# EAGLE design NEW LINE 十字1 (EAGLE 9.6.2)

## Sheet 1 of 3
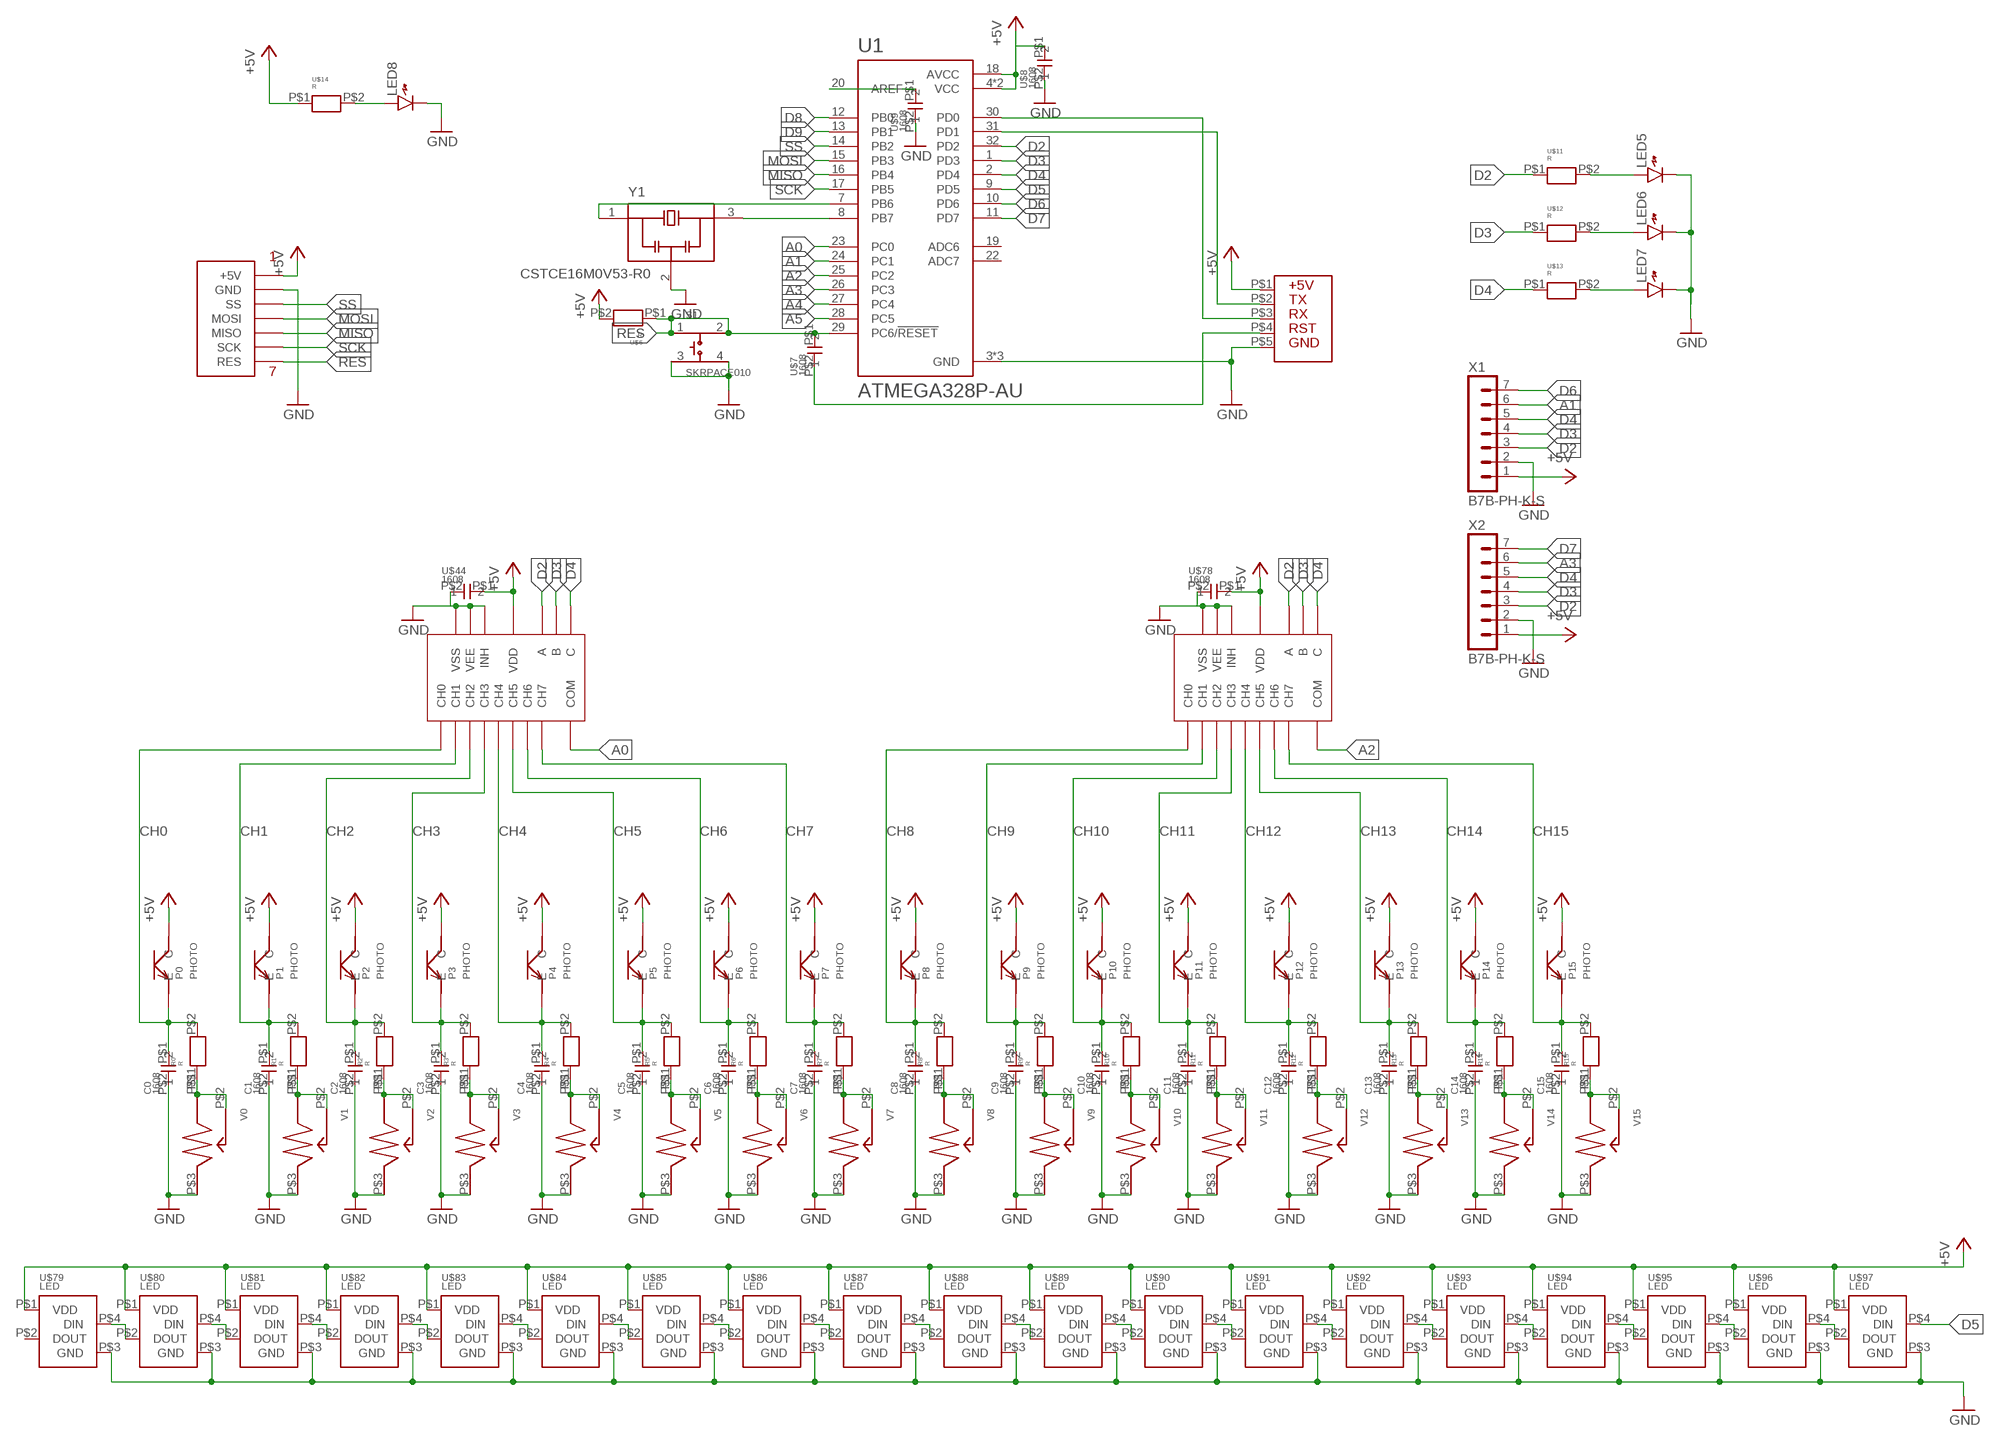
[diagram p0: schematic, sheet 1]

### Parts
C0  1608  [CON]
C1  1608  [CON]
C2  1608  [CON]
C3  1608  [CON]
C4  1608  [CON]
C5  1608  [CON]
C6  1608  [CON]
C7  1608  [CON]
C8  1608  [CON]
C9  1608  [CON]
C10  1608  [CON]
C11  1608  [CON]
C12  1608  [CON]
C13  1608  [CON]
C14  1608  [CON]
C15  1608  [CON]
LED5  LED1608  [LED1608]
LED6  LED1608  [LED1608]
LED7  LED1608  [LED1608]
LED8  LED1608  [LED1608]
P0  PHOTO  [PHOTO]
P1  PHOTO  [PHOTO]
P2  PHOTO  [PHOTO]
P3  PHOTO  [PHOTO]
P4  PHOTO  [PHOTO]
P5  PHOTO  [PHOTO]
P6  PHOTO  [PHOTO]
P7  PHOTO  [PHOTO]
P8  PHOTO  [PHOTO]
P9  PHOTO  [PHOTO]
P10  PHOTO  [PHOTO]
P11  PHOTO  [PHOTO]
P12  PHOTO  [PHOTO]
P13  PHOTO  [PHOTO]
P14  PHOTO  [PHOTO]
P15  PHOTO  [PHOTO]
R0  R  [1608]
R1  R  [1608]
R2  R  [1608]
R3  R  [1608]
R4  R  [1608]
R5  R  [1608]
R6  R  [1608]
R7  R  [1608]
R8  R  [1608]
R9  R  [1608]
R10  R  [1608]
R11  R  [1608]
R12  R  [1608]
R13  R  [1608]
R14  R  [1608]
R15  R  [1608]
S1  SKRPACE010  [SW_SKRPACE010]
U1  ATMEGA328P-AU  [QFP80P900X900X120-32N]
U$1  AM  [SOP65P640X120-16N]
U$6  R  [1608]
U$7  1608  [CON]
U$8  1608  [CON]
U$9  1608  [CON]
U$10  SI  [SI]
U$11  R  [1608]
U$12  R  [1608]
U$13  R  [1608]
U$14  R  [1608]
U$15  SPI  [SPI]
U$44  1608  [CON]
U$45  AM  [SOP65P640X120-16N]
U$78  1608  [CON]
U$79  LED  [LED]
U$80  LED  [LED]
U$81  LED  [LED]
U$82  LED  [LED]
U$83  LED  [LED]
U$84  LED  [LED]
U$85  LED  [LED]
U$86  LED  [LED]
U$87  LED  [LED]
U$88  LED  [LED]
U$89  LED  [LED]
U$90  LED  [LED]
U$91  LED  [LED]
U$92  LED  [LED]
U$93  LED  [LED]
U$94  LED  [LED]
U$95  LED  [LED]
U$96  LED  [LED]
U$97  LED  [LED]
V0  VR  [VR]
V1  VR  [VR]
V2  VR  [VR]
V3  VR  [VR]
V4  VR  [VR]
V5  VR  [VR]
V6  VR  [VR]
V7  VR  [VR]
V8  VR  [VR]
V9  VR  [VR]
V10  VR  [VR]
V11  VR  [VR]
V12  VR  [VR]
V13  VR  [VR]
V14  VR  [VR]
V15  VR  [VR]
X1  B7B-PH-K-S  [B7B-PH-K-S]
X2  B7B-PH-K-S  [B7B-PH-K-S]
Y1  CSTCE16M0V53-R0  [OSC_CSTCE16M0V53-R0]

### Nets
+5V: P0.P$1(C) P1.P$1(C) P2.P$1(C) P3.P$1(C) P4.P$1(C) P5.P$1(C) P6.P$1(C) P7.P$1(C) P8.P$1(C) P9.P$1(C) P10.P$1(C) P11.P$1(C) P12.P$1(C) P13.P$1(C) P14.P$1(C) P15.P$1(C) U1.4(VCC) U1.6(VCC) U1.18(AVCC) U$1.16(VDD) U$6.P$2 U$8.P$1 U$10.P$1 U$14.P$1 U$15.P$1(+5V) U$44.P$1 U$45.16(VDD) U$78.P$1 U$79.P$1(VDD) U$80.P$1(VDD) U$81.P$1(VDD) U$82.P$1(VDD) U$83.P$1(VDD) U$84.P$1(VDD) U$85.P$1(VDD) U$86.P$1(VDD) U$87.P$1(VDD) U$88.P$1(VDD) U$89.P$1(VDD) U$90.P$1(VDD) U$91.P$1(VDD) U$92.P$1(VDD) U$93.P$1(VDD) U$94.P$1(VDD) U$95.P$1(VDD) U$96.P$1(VDD) U$97.P$1(VDD) X1.1 X2.1
A0: U1.23(PC0) U$1.3(COM)
A1: U1.24(PC1) X1.6
A2: U1.25(PC2) U$45.3(COM)
A3: U1.26(PC3) X2.6
A4: U1.27(PC4)
A5: U1.28(PC5)
CH0: C0.P$1 P0.P$2(E) R0.P$2 U$1.13(CH0)
CH1: C1.P$1 P1.P$2(E) R1.P$2 U$1.14(CH1)
CH2: C2.P$1 P2.P$2(E) R2.P$2 U$1.15(CH2)
CH3: C3.P$1 P3.P$2(E) R3.P$2 U$1.12(CH3)
CH4: C4.P$1 P4.P$2(E) R4.P$2 U$1.1(CH4)
CH5: C5.P$1 P5.P$2(E) R5.P$2 U$1.5(CH5)
CH6: C6.P$1 P6.P$2(E) R6.P$2 U$1.2(CH6)
CH7: C7.P$1 P7.P$2(E) R7.P$2 U$1.4(CH7)
CH8: C8.P$1 P8.P$2(E) R8.P$2 U$45.13(CH0)
CH9: C9.P$1 P9.P$2(E) R9.P$2 U$45.14(CH1)
CH10: C10.P$1 P10.P$2(E) R10.P$2 U$45.15(CH2)
CH11: C11.P$1 P11.P$2(E) R11.P$2 U$45.12(CH3)
CH12: C12.P$1 P12.P$2(E) R12.P$2 U$45.1(CH4)
CH13: C13.P$1 P13.P$2(E) R13.P$2 U$45.5(CH5)
CH14: C14.P$1 P14.P$2(E) R14.P$2 U$45.2(CH6)
CH15: C15.P$1 P15.P$2(E) R15.P$2 U$45.4(CH7)
D2: U1.32(PD2) U$1.11(A) U$11.P$1 U$45.11(A) X1.3 X2.3
D3: U1.1(PD3) U$1.10(B) U$12.P$1 U$45.10(B) X1.4 X2.4
D4: U1.2(PD4) U$1.9(C) U$13.P$1 U$45.9(C) X1.5 X2.5
D5: U1.9(PD5) U$97.P$4(DIN)
D6: U1.10(PD6) X1.7
D7: U1.11(PD7) X2.7
D8: U1.12(PB0)
D9: U1.13(PB1)
GND: C0.P$2 C1.P$2 C2.P$2 C3.P$2 C4.P$2 C5.P$2 C6.P$2 C7.P$2 C8.P$2 C9.P$2 C10.P$2 C11.P$2 C12.P$2 C13.P$2 C14.P$2 C15.P$2 LED5.K LED6.K LED7.K LED8.K S1.3 S1.4 U1.3(GND) U1.5(GND) U1.21(GND) U$1.6(INH) U$1.7(VEE) U$1.8(VSS) U$8.P$2 U$9.P$2 U$10.P$5 U$15.P$2(GND) U$44.P$2 U$45.6(INH) U$45.7(VEE) U$45.8(VSS) U$78.P$2 U$79.P$3(GND) U$80.P$3(GND) U$81.P$3(GND) U$82.P$3(GND) U$83.P$3(GND) U$84.P$3(GND) U$85.P$3(GND) U$86.P$3(GND) U$87.P$3(GND) U$88.P$3(GND) U$89.P$3(GND) U$90.P$3(GND) U$91.P$3(GND) U$92.P$3(GND) U$93.P$3(GND) U$94.P$3(GND) U$95.P$3(GND) U$96.P$3(GND) U$97.P$3(GND) V0.P$3 V1.P$3 V2.P$3 V3.P$3 V4.P$3 V5.P$3 V6.P$3 V7.P$3 V8.P$3 V9.P$3 V10.P$3 V11.P$3 V12.P$3 V13.P$3 V14.P$3 V15.P$3 X1.2 X2.2 Y1.2(GND)
MISO: U1.16(PB4) U$15.P$5(MISO)
MOSI: U1.15(PB3) U$15.P$4(MOSI)
N$2: R0.P$1 V0.P$1 V0.P$2
N$3: R1.P$1 V1.P$1 V1.P$2
N$4: R2.P$1 V2.P$1 V2.P$2
N$5: U1.20(AREF) U$9.P$1
N$6: U$7.P$2 U$10.P$4
N$7: U1.31(PD1) U$10.P$2
N$8: U1.30(PD0) U$10.P$3
N$9: U1.7(PB6) Y1.1(IN)
N$10: U1.8(PB7) Y1.3(OUT)
N$11: LED7.A U$13.P$2
N$12: LED6.A U$12.P$2
N$13: LED5.A U$11.P$2
N$14: LED8.A U$14.P$2
N$15: R3.P$1 V3.P$1 V3.P$2
N$16: R4.P$1 V4.P$1 V4.P$2
N$17: R5.P$1 V5.P$1 V5.P$2
N$18: R6.P$1 V6.P$1 V6.P$2
N$19: R7.P$1 V7.P$1 V7.P$2
N$21: R8.P$1 V8.P$1 V8.P$2
N$22: R9.P$1 V9.P$1 V9.P$2
N$23: R10.P$1 V10.P$1 V10.P$2
N$24: R11.P$1 V11.P$1 V11.P$2
N$25: R12.P$1 V12.P$1 V12.P$2
N$26: R13.P$1 V13.P$1 V13.P$2
N$27: R14.P$1 V14.P$1 V14.P$2
N$28: R15.P$1 V15.P$1 V15.P$2
N$31: U$79.P$4(DIN) U$80.P$2(DOUT)
N$32: U$80.P$4(DIN) U$81.P$2(DOUT)
N$33: U$81.P$4(DIN) U$82.P$2(DOUT)
N$34: U$82.P$4(DIN) U$83.P$2(DOUT)
N$35: U$83.P$4(DIN) U$84.P$2(DOUT)
N$36: U$84.P$4(DIN) U$85.P$2(DOUT)
N$37: U$85.P$4(DIN) U$86.P$2(DOUT)
N$38: U$86.P$4(DIN) U$87.P$2(DOUT)
N$39: U$87.P$4(DIN) U$88.P$2(DOUT)
N$40: U$88.P$4(DIN) U$89.P$2(DOUT)
N$41: U$89.P$4(DIN) U$90.P$2(DOUT)
N$42: U$90.P$4(DIN) U$91.P$2(DOUT)
N$43: U$91.P$4(DIN) U$92.P$2(DOUT)
N$44: U$92.P$4(DIN) U$93.P$2(DOUT)
N$45: U$93.P$4(DIN) U$94.P$2(DOUT)
N$46: U$94.P$4(DIN) U$95.P$2(DOUT)
N$47: U$95.P$4(DIN) U$96.P$2(DOUT)
N$48: U$96.P$4(DIN) U$97.P$2(DOUT)
RES: S1.1 S1.2 U1.29(PC6/!RESET) U$6.P$1 U$7.P$1 U$15.P$7(RES)
SCK: U1.17(PB5) U$15.P$6(SCK)
SS: U1.14(PB2) U$15.P$3(SS)
Unconnected: U1.19(ADC6) U1.22(ADC7) U$79.P$2(DOUT)

## Sheet 2 of 3

## Sheet 3 of 3

## Library data of the parts
C0 C1-C15 U$7-U$9 U$44 U$78 = con1608:1608
LED5-LED8 = generic:LED: Generic LEDs
P0 P1-P15 = Chip phototransistor:PHOTO
R0 R1-R15 U$6 U$11-U$14 = R 1608:R
S1 = SKRPACE010:SKRPACE010: Switch Tactile N.O. SPST Button J-Bend 0.05A 16VDC 2.55N SMD Automotive T/R Check prices <https://pricing.snapeda.com/parts/SKRPACE010/ALPS/view-part?ref=eda>; AVAILABILITY: In Stock; DESCRIPTION: Switch Tactile N.O. SPST Button J-Bend 0.05A 16VDC 2.55N SMD Automotive T/R; MF: ALPS; MP: SKRPACE010; PACKAGE: None; PRICE: None
U1 = ATMEGA328P-AU:ATMEGA328P-AU: ATmega Series 20 MHz 32 KB Flash 2 KB SRAM 8-Bit Microcontroller - TQFP-32 Check prices <https://pricing.snapeda.com/parts/ATMEGA328P-AU/Microchip%20Technology/view-part?ref=eda>; AVAILABILITY: In Stock; DESCRIPTION: AVR AVR® ATmega Microcontroller IC 8-Bit 20MHz 32KB (16K x 16) FLASH 32-TQFP (7x7); MF: Microchip Technology; MP: ATMEGA328P-AU; PACKAGE: TQFP-32 Microchip; PRICE: None
U$1 U$45 = アナログマルチプレクサ:AM
U$10 = プログラム入力:SI
U$15 = SPI用PH7ピン:SPI
U$79-U$97 = フルカラーLED:LED
V0 V1-V15 = VR tippu:VR
X1 X2 = con-JST PH:B7B-PH: JST PH series header 2.00mm pitch disconnectable crimp style connectors, vertical (side entry type), 7 pins
Y1 = CSTCE16M0V53-R0:CSTCE16M0V53-R0: 20MHz Ceramic Resonator Built in Capacitor 15pF +/- 0.2% -40C - 125C Surface Mount; MANUFACTURER: Murata; MAXIMUM_PACKAGE_HEIGHT: 1.00mm; PARTREV: May 7, 2019; STANDARD: Manufacturer Recommendations

## Board
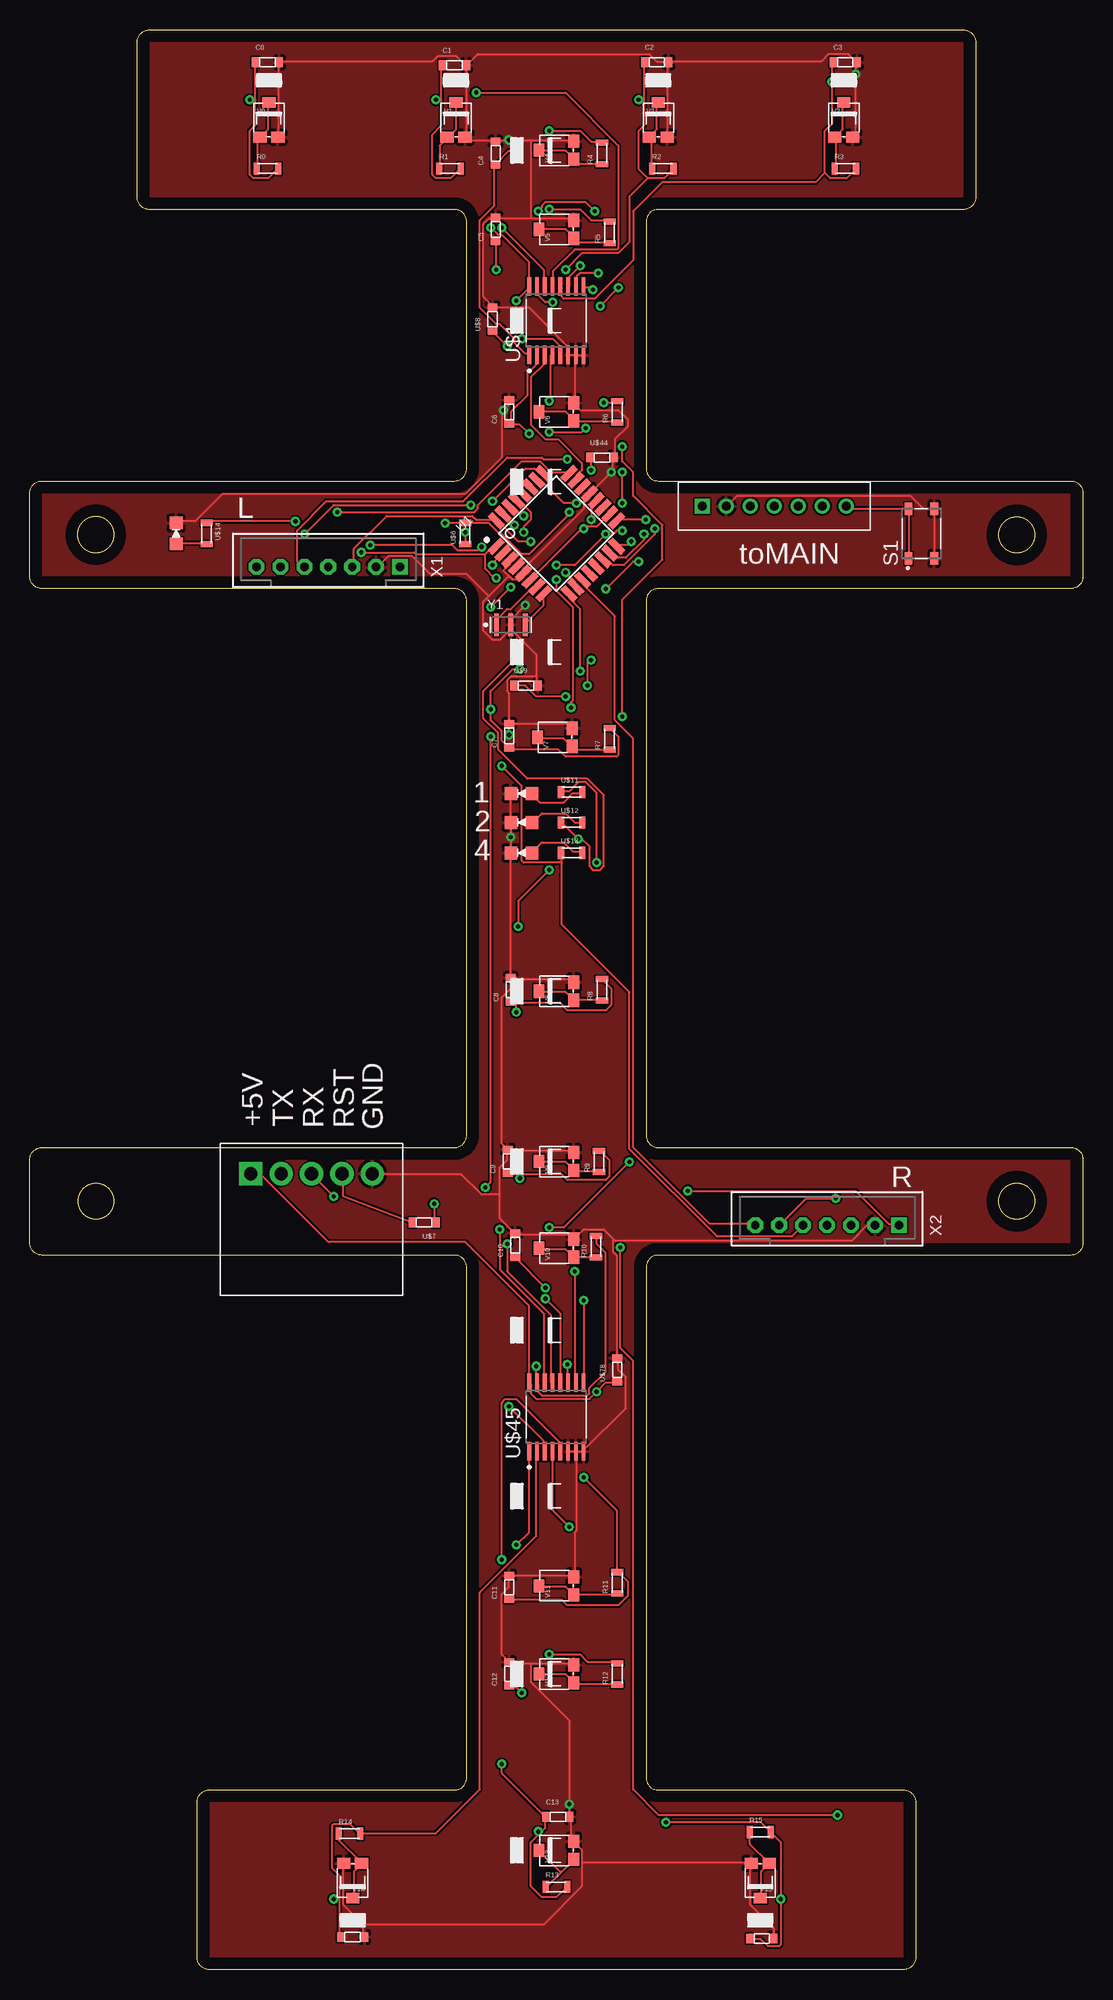
[diagram p1: board, top side]
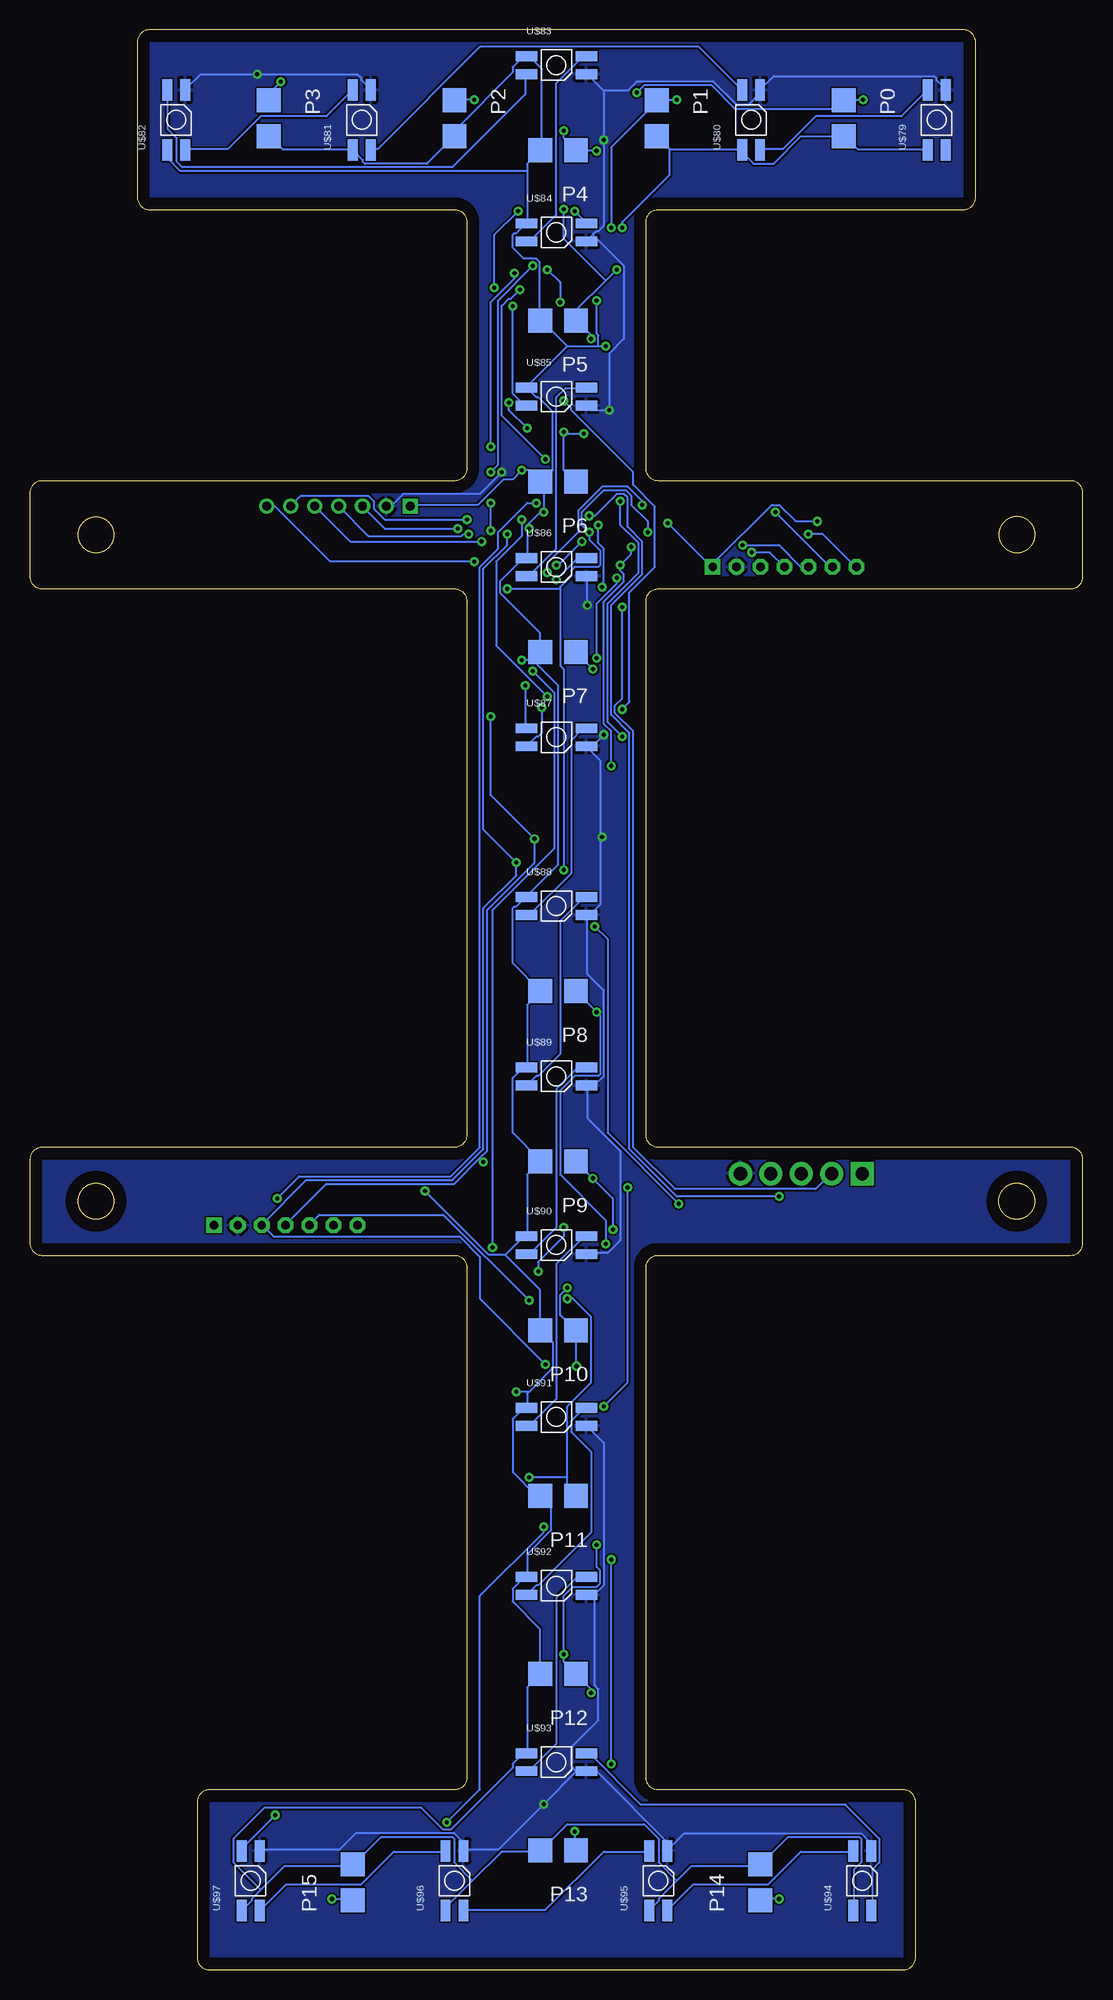
[diagram p2: board, bottom side, seen from below]

Size 87.92 x 162 mm. Coordinates in mm from the lower left corner, seen from the top.
Outline: 8.96,161 arc-90 9.96,162 77.96,162 arc-90 78.96,161 78.96,148 arc-90 77.96,147 52.46,147 arc90 51.46,146 51.46,125.34 arc90 52.46,124.34 86.92,124.34 arc-90 87.92,123.34 87.92,116.34 arc-90 86.92,115.34 52.46,115.34 arc90 51.46,114.34 51.46,69.66 arc90 52.46,68.66 86.92,68.66 arc-90 87.92,67.66 87.92,60.66 arc-90 86.92,59.66 52.46,59.66 arc90 51.46,58.66 51.46,16 arc90 52.46,15 72.96,15 arc-90 73.96,14 73.96,1 arc-90 72.96,0 14.96,0 arc-90 13.96,1 13.96,14 arc-90 14.96,15 35.46,15 arc90 36.46,16 36.46,58.66 arc90 35.46,59.66 1,59.66 arc-90 0,60.66 0,67.66 arc-90 1,68.66 35.46,68.66 arc90 36.46,69.66 36.46,114.34 arc90 35.46,115.34 1,115.34 arc-90 0,116.34 0,123.34 arc-90 1,124.34 35.46,124.34 arc90 36.46,125.34 36.46,146 arc90 35.46,147 9.96,147 arc-90 8.96,148 8.96,161
Outline: circle at 82.4,64.16 radius 1.5
Outline: circle at 5.52,64.16 radius 1.5
Outline: circle at 82.4,119.84 radius 1.5
Outline: circle at 5.5,119.85 radius 1.5
Outline: circle at 82.4,119.84 radius 1.5
Outline: circle at 5.5,119.85 radius 1.5
Outline: circle at 82.4,64.16 radius 1.5
Outline: circle at 5.52,64.16 radius 1.5
Outline: circle at 82.4,64.16 radius 1.5
Outline: circle at 5.52,64.16 radius 1.5
Outline: circle at 82.4,119.84 radius 1.5
Outline: circle at 5.5,119.85 radius 1.5
Copper layers (1*16): Top 0.035mm / dielectric 1.5mm / Bottom 0.035mm
Design rules "default": minimum track width 6mil, minimum drill 0.35mm, track to track 6mil, track to pad 6mil, pad to pad 6mil, via to via 6mil, smd to smd 6mil, copper to edge 40mil, drill to drill 6mil, minimum pad ring 10mil, minimum via ring 8mil, stop-mask expansion 4mil, vias tented up to drill 0mil, thermal gap 10mil

### Footprints (pad centres in the part's own frame; a part is rotated, then mirrored left to right if it is on the bottom)
CON = smd 0.6 x 0.813: P$1 -1,0; P$2 1,0
LED1608 = smd 1.05 x 1.08: A -0.875,0; K 0.875,0
PHOTO = smd 2 x 2 bottom: P$1 -1.365,0; P$2 1.635,0
1608 = smd 0.508 x 1.016: P$1 -0.889,0; P$2 0.889,0
SW_SKRPACE010 = smd 1.05 x 0.65: 1 -2.075,1.075; 2 2.075,1.075; 3 -2.075,-1.075; 4 2.075,-1.075
QFP80P900X900X120-32N = smd 1.5 x 0.55: 1 -4.3,2.8; 2 -4.3,2; 3 -4.3,1.2; 4 -4.3,0.4; 5 -4.3,-0.4; 6 -4.3,-1.2; 7 -4.3,-2; 8 -4.3,-2.8; 17 4.3,-2.8; 18 4.3,-2; 19 4.3,-1.2; 20 4.3,-0.4; 21 4.3,0.4; 22 4.3,1.2; 23 4.3,2; 24 4.3,2.8 | smd 0.55 x 1.5: 9 -2.8,-4.3; 10 -2,-4.3; 11 -1.2,-4.3; 12 -0.4,-4.3; 13 0.4,-4.3; 14 1.2,-4.3; 15 2,-4.3; 16 2.8,-4.3; 25 2.8,4.3; 26 2,4.3; 27 1.2,4.3; 28 0.4,4.3; 29 -0.4,4.3; 30 -1.2,4.3; 31 -2,4.3; 32 -2.8,4.3
SOP65P640X120-16N = smd 1.57 x 0.41: 1 -2.87,2.275; 2 -2.87,1.625; 3 -2.87,0.975; 4 -2.87,0.325; 5 -2.87,-0.325; 6 -2.87,-0.975; 7 -2.87,-1.625; 8 -2.87,-2.275; 9 2.87,-2.275; 10 2.87,-1.625; 11 2.87,-0.975; 12 2.87,-0.325; 13 2.87,0.325; 14 2.87,0.975; 15 2.87,1.625; 16 2.87,2.275
SI = drill 1.1 pad 1.93 square: P$1 -7.62,0 | drill 1.1 pad 1.93: P$2 -5.08,0; P$3 -2.54,0; P$4 0,0; P$5 2.54,0
SPI = drill 0.75 square: P$1 0,0 | drill 0.75: P$2 2,0; P$3 4,0; P$4 6,0; P$5 8,0; P$6 10,0; P$7 12,0
LED = smd 1.8 x 0.82: P$1 -2.5,0.75; P$2 -2.5,-0.75; P$3 2.5,-0.75; P$4 2.5,0.75
VR = smd 1.1 x 0.9: P$1 0,1.45; P$2 -0.75,-1.45; P$3 0.75,-1.45
B7B-PH-K-S = drill 0.7 pad 1.3 square: 1 6,0 | drill 0.7 pad 1.3 octagon: 2 4,0; 3 2,0; 4 0,0; 5 -2,0; 6 -4,0; 7 -6,0
OSC_CSTCE16M0V53-R0 = smd 0.4 x 1.9: 1 -1.2,0; 2 0,0; 3 1.2,0

### Placement (x,y rotation side)
C0  19.83,159.31 0 top
C1  35.45,159.06 0 top
C2  52.34,159.31 0 top
C3  68.09,159.31 0 top
C4  38.88,151.69 90 top
C5  38.88,145.34 90 top
C6  40.02,130.1 90 top
C7  40.02,103.05 90 top
C8  40.15,81.84 90 top
C9  39.9,67.49 90 top
C10  40.53,60.5 90 top
C11  40.02,31.93 90 top
C12  40.02,24.69 90 top
C13  44.09,12.75 0 top
C14  26.94,2.72 0 top
C15  61.11,2.59 0 top
LED5  41.04,98.22 180 top
LED6  41.04,95.81 180 top
LED7  41.04,93.27 180 top
LED8  12.21,119.94 90 top
P0  19.96,154.48 90 top
P1  35.58,154.48 90 top
P2  52.47,154.48 90 top
P3  67.96,154.48 90 top
P4  43.96,151.94 180 top
P5  43.96,137.72 180 top
P6  43.96,124.26 180 top
P7  43.96,110.03 180 top
P8  43.96,81.71 180 top
P9  43.96,67.49 180 top
P10  43.96,53.39 180 top
P11  43.96,39.55 180 top
P12  43.96,24.69 180 top
P13  43.96,9.96 180 top
P14  26.94,7.42 270 top
P15  60.98,7.42 270 top
R0  19.83,150.42 0 top
R1  35.07,150.42 0 top
R2  52.85,150.42 0 top
R3  68.09,150.42 0 top
R4  47.77,151.69 90 top
R5  48.41,145.09 90 top
R6  49.04,130.1 90 top
R7  48.41,102.8 90 top
R8  47.77,81.84 90 top
R9  47.52,67.49 90 top
R10  47.26,60.38 90 top
R11  49.04,32.31 90 top
R12  49.04,24.69 90 top
R13  43.96,6.91 0 top
R14  26.69,11.36 0 top
R15  60.98,11.48 0 top
S1  74.44,119.94 90 top
U1  43.96,119.94 45 top
U$1  43.96,137.72 90 top
U$6  36.34,119.94 90 top
U$7  32.91,62.41 180 top
U$8  38.63,137.85 90 top
U$9  41.42,107.24 0 top
U$10  26.05,66.47 0 top
U$11  45.23,98.35 0 top
U$12  45.23,95.81 0 top
U$13  45.23,93.27 0 top
U$14  14.75,119.94 270 top
U$15  56.15,122.23 0 top
U$44  47.77,126.29 0 top
U$45  43.96,46.15 90 top
U$78  49.04,50.09 90 top
U$79  12.21,154.48 90 bottom
U$80  27.7,154.48 90 bottom
U$81  60.22,154.48 90 bottom
U$82  75.71,154.48 90 bottom
U$83  43.96,159.06 0 bottom
U$84  43.96,145.09 0 bottom
U$85  43.96,131.37 0 bottom
U$86  43.96,117.15 0 bottom
U$87  43.96,102.92 0 bottom
U$88  43.96,88.83 0 bottom
U$89  43.96,74.6 0 bottom
U$90  43.96,60.5 0 bottom
U$91  43.96,46.15 0 bottom
U$92  43.96,32.06 0 bottom
U$93  43.96,17.32 0 bottom
U$94  18.43,7.42 90 bottom
U$95  35.45,7.42 90 bottom
U$96  52.47,7.42 90 bottom
U$97  69.49,7.42 90 bottom
V0  19.96,154.48 0 top
V1  35.58,154.48 0 top
V2  52.47,154.48 0 top
V3  67.96,154.48 0 top
V4  43.96,151.94 90 top
V5  43.96,145.34 90 top
V6  43.96,130.1 90 top
V7  43.83,102.92 90 top
V8  43.96,81.71 90 top
V9  43.96,67.49 90 top
V10  43.96,60.25 90 top
V11  43.96,32.06 90 top
V12  43.96,24.69 90 top
V13  43.96,9.96 90 top
V14  26.94,7.42 180 top
V15  60.98,7.42 180 top
X1  24.91,117.15 0 top
X2  66.57,62.16 0 top
Y1  40.15,112.32 0 top

### Tracks (layer width: path | path; a pad name or v marks a point on that pad's centre or on a via)
+5V  (via drill 0.35)
  Top 0.152: v22.17,120.96 14.85,120.96 U$14.P$1 | v39.84,135.59 38.63,136.81 U$8.P$1 | v40.61,139.4 41.67,140.46 U$1.16 41.67,140.62 41.67,142.6 39.39,144.88 39.08,144.88 v38.47,145.49 | 46.09,120.35 46.25,120.5 47.31,120.5 48.38,121.57 U1.18 | 46.09,120.35 41.83,116.08 U1.6 | v46.55,107.24 46.55,109.07 v46.86,109.37 | 36.34,120.8 38.32,120.8 39.24,119.89 39.39,119.89 41.06,118.21 | 41.06,118.21 41.06,117.6 40.76,117.3 U1.4 | v46.86,125.22 46.86,126.29 U$44.P$1 | 41.06,118.21 41.67,118.21 45.03,121.57 v45.03,121.72 | v46.25,120.35 46.09,120.35 | 36.34,120.8 v34.66,120.8 | 36.34,120.8 U$6.P$2 | U$78.P$1 48.99,49.02 48.08,49.02 v47.31,48.26 46.7,47.65 42.28,47.65 41.83,48.11 41.83,48.87 U$45.16 41.67,49.02 41.67,55.42 36.34,60.76 24.91,60.76 19.27,66.4 18.51,66.4 U$10.P$1 | v54.93,65.03 68.95,65.03 71.7,62.28 72.46,62.28 X2.1
  Bottom 0.152: P3.P$1 67.89,153.11 66.82,152.05 61.03,152.05 U$81.P$1 60.88,151.89 60.11,151.13 60.11,150.98 59.96,150.83 54.78,150.83 52.49,153.11 P2.P$1 52.34,153.26 52.34,153.72 47.62,158.45 47.62,158.9 46.86,159.67 46.55,159.67 U$83.P$1 46.4,159.67 46.09,159.67 45.18,158.75 45.18,152.05 P4.P$1 45.33,151.89 46.4,150.83 46.4,150.22 | 46.4,150.22 46.4,145.95 U$84.P$1 46.55,145.8 47.31,145.03 47.47,145.03 47.62,144.88 47.62,143.82 46.7,142.9 45.64,142.9 45.33,142.6 45.33,137.72 P5.P$1 45.18,137.72 43.05,135.59 | 46.4,150.22 75.35,150.22 76.42,151.28 76.42,151.89 U$82.P$1 | U$79.P$1 13.02,152.05 18.81,152.05 19.88,153.11 P0.P$1 20.03,153.11 23.54,153.11 25.82,150.83 27.5,150.83 28.57,151.89 U$80.P$1 28.57,152.05 34.51,152.05 | 34.51,152.05 P1.P$1 | v22.17,120.96 24,120.96 25.37,122.33 25.98,122.33 30.85,117.45 30.85,117.15 X1.1 31.01,117.15 v34.66,120.8 | 43.05,135.59 40.45,135.59 | 40.45,135.59 v39.84,135.59 | v40.61,139.4 40.61,136.65 40.45,136.5 40.45,135.59 | 43.05,135.59 46.4,132.23 U$85.P$1 46.4,132.08 45.64,131.32 45.48,131.32 44.27,130.1 44.27,125.22 45.18,124.31 P6.P$1 | v46.55,107.24 46.55,103.73 U$87.P$1 | 45.94,109.37 v46.86,109.37 | 45.94,109.37 45.33,109.98 P7.P$1 | P6.P$1 45.33,124.31 46.25,125.22 v46.86,125.22 47.62,124.46 48.38,124.46 50.51,122.33 56.15,122.33 U$15.P$1 | 46.4,120.35 46.4,120.65 45.18,121.87 | 46.4,120.35 46.4,117.91 U$86.P$1 46.55,117.76 46.86,117.76 48.68,115.93 48.68,115.01 45.33,111.66 45.33,110.14 P7.P$1 | 45.18,121.87 45.03,122.02 45.03,124 45.18,124.16 P6.P$1 | 45.18,121.87 v45.03,121.72 | 46.4,120.35 v46.25,120.35
  Bottom 0.152: 34.51,152.05 34.51,149.91 38.47,145.95 v38.47,145.49 | U$94.P$1 19.12,4.98 19.12,8.33 18.51,8.94 18.51,10.92 18.66,11.08 24.61,11.08 26.89,8.79 P14.P$1 27.04,8.64 32.68,8.64 33.9,7.42 | 33.9,7.42 35.43,5.89 35.43,5.74 36.19,4.98 U$95.P$1 | 50.97,7.42 48.53,9.86 45.33,9.86 P13.P$1 45.18,10.01 43.05,12.14 36.65,12.14 35.43,10.92 35.43,8.94 33.9,7.42 | 50.97,7.42 53.1,5.28 53.1,4.98 U$96.P$1 | 68.65,6.66 66.67,8.64 61.03,8.64 P15.P$1 60.88,8.79 58.59,11.08 52.65,11.08 52.49,10.92 52.49,8.94 50.97,7.42 | 68.65,6.66 69.41,5.89 69.41,5.74 70.17,4.98 U$97.P$1 | 46.25,48.26 44.27,50.24 44.27,52.38 45.18,53.29 P10.P$1 45.33,53.44 45.33,56.8 48.23,59.69 | 46.25,48.26 46.4,48.11 46.4,47.04 U$91.P$1 46.55,47.04 47.62,45.98 47.62,41.56 45.64,39.57 45.33,39.57 P11.P$1 45.18,39.42 44.42,38.66 44.42,36.68 46.4,34.7 46.4,32.87 U$92.P$1 46.55,32.87 47.62,31.8 47.62,30.73 45.33,28.45 45.33,24.79 P12.P$1 45.33,24.64 46.4,23.57 46.4,18.09 U$93.P$1 46.55,17.93 46.86,17.93 47.62,17.17 47.62,16.87 52.8,11.69 53.41,11.69 55.24,13.51 68.34,13.51 70.94,10.92 70.94,8.94 68.65,6.66 | v54.93,65.03 49.6,59.69 48.23,59.69 | 48.23,59.69 46.55,61.37 U$90.P$1 46.4,61.37 46.4,66.4 45.33,67.46 P9.P$1 45.33,67.62 47.62,69.9 47.62,74.47 46.86,75.24 46.55,75.24 U$89.P$1 46.4,75.39 46.4,80.57 45.33,81.64 P8.P$1 45.33,81.79 47.62,84.08 47.62,88.65 47.47,88.8 47.31,88.8 46.55,89.56 U$88.P$1 46.4,89.71 43.81,92.31 43.81,107.24 45.94,109.37 | 46.25,48.26 v47.31,48.26 | 45.94,109.37 P7.P$1
A0
  Top 0.152: U1.23 45.64,124.46 45.64,124.77 46.09,125.22 46.09,125.83 44.11,127.81 43.05,127.81 41.83,129.03 41.83,133 42.89,134.06 42.89,134.82 U$1.3
A1  (via drill 0.35)
  Top 0.152: v25.67,121.72 37.1,121.72 37.41,122.02 37.41,122.33 41.06,125.98 42.59,125.98 43.5,125.07 44.87,125.07 U1.24
  Bottom 0.152: v25.67,121.72 21.1,117.15 X1.6
A2  (via drill 0.35)
  Top 0.152: v38.63,122.63 41.37,125.38 42.13,125.38 42.44,125.07 42.89,125.07 U1.25 | v38.47,102.97 38.47,65.79 v38.02,65.33 | v40,47.04 42.89,44.15 42.89,43.38 U$45.3
  Bottom 0.152: v38.63,122.63 38.63,120.65 37.1,119.13 37.1,116.69 39.69,114.1 39.69,104.19 v38.47,102.97 | v38.02,65.33 38.02,49.02 v40,47.04
A3  (via drill 0.35)
  Top 0.152: v45.64,122.48 44.57,122.48 42.74,124.31 42.44,124.31 U1.26 | v67.28,64.42 64.84,64.42 62.7,62.28 X2.6
  Bottom 0.152: v45.64,122.48 46.4,122.48 48.84,120.04 48.84,118.67 50.36,117.15 50.36,68.68 52.8,66.24 65.45,66.24 v67.28,64.42
CH0  (via drill 0.35)
  Top 0.152: 18.81,156.16 18.81,154.03 18.36,153.57 18.36,149.91 18.66,149.61 19.88,149.61 20.64,150.37 R0.P$2 | 18.81,156.16 18.81,159.21 C0.P$1 | v37.25,156.77 44.72,156.77 49.14,152.35 49.14,143.82 48.99,143.66 45.48,143.66 43.66,141.84 43.66,140.62 U$1.13 | v18.36,156.16 18.81,156.16
  Bottom 0.152: v37.25,156.77 36.65,157.38 31.01,157.38 29.02,155.4 20.64,155.4 20.03,156.01 P0.P$2 19.88,156.16 v18.36,156.16
CH1  (via drill 0.35)
  Top 0.152: 34.36,156.16 34.36,154.03 33.6,153.26 33.6,149.91 33.9,149.61 35.12,149.61 35.88,150.37 R1.P$2 | 34.36,156.16 34.36,159.06 C1.P$1 | v39.39,145.49 42.89,141.99 42.89,140.62 U$1.14 | v33.9,156.16 34.36,156.16
  Bottom 0.152: v39.39,145.49 39.39,152.2 35.58,156.01 P1.P$2 35.58,156.16 v33.9,156.16
CH2  (via drill 0.35)
  Top 0.152: 51.27,156.16 51.27,154.03 50.82,153.57 50.82,150.37 51.58,149.61 | 51.27,156.16 51.27,159.21 C2.P$1 | 51.58,149.61 52.95,149.61 53.71,150.37 R2.P$2 | v43.66,139.24 43.05,139.24 42.44,139.85 42.44,140.46 U$1.15 | v44.72,141.99 46.09,143.36 49.14,143.36 50.06,144.27 50.06,148.08 51.58,149.61 | 51.27,156.16 v50.82,156.16
  Bottom 0.152: v43.66,139.24 43.66,140.92 v44.72,141.99 | v50.82,156.16 52.34,156.16 P2.P$2
CH3  (via drill 0.35)
  Top 0.152: 66.36,150.06 66.36,153.57 66.97,154.18 v66.97,157.68 66.97,159.21 C3.P$1 | 66.36,150.06 66.82,149.61 68.19,149.61 68.95,150.37 R3.P$2 | 66.36,150.06 65.6,149.3 52.8,149.3 50.36,146.86 50.36,142.75 47.16,139.55 44.57,139.55 44.42,139.7 44.42,140.46 U$1.12
  Bottom 0.152: v66.97,157.68 67.89,156.77 67.89,156.16 P3.P$2
CH4  (via drill 0.35)
  Top 0.152: v43.35,153.57 45.94,153.57 46.86,152.66 47.77,152.66 R4.P$2 | U$1.1 41.67,134.98 41.37,134.98 40.45,135.89 40.45,136.2 39.24,137.41 38.93,137.41 37.56,138.79 37.56,146.1 38.78,147.32 38.78,150.67 C4.P$1 38.93,150.83 40,151.89 v40.61,151.89
  Bottom 0.152: v43.35,153.57 43.35,152.96 42.44,152.05 P4.P$2 42.28,151.89 v40.61,151.89
CH5  (via drill 0.35)
  Top 0.152: v38.93,141.99 38.93,144.27 C5.P$1 | v43.35,147.02 45.94,147.02 46.86,146.1 48.38,146.1 R5.P$2 | v41.06,136.2 43.66,136.2 44.27,135.59 44.27,134.98 U$1.5
  Bottom 0.152: 39.84,141.07 42.28,138.63 42.28,137.72 | 39.84,141.07 v38.93,141.99 | v43.35,147.02 43.35,144.58 39.84,141.07 | v41.06,136.2 41.06,136.5 42.28,137.72 | 42.28,137.72 P5.P$2
CH6  (via drill 0.35)
  Top 0.152: U$1.2 42.28,134.82 42.28,134.06 41.52,133.3 41.52,131.47 40.15,130.1 40.15,129.19 C6.P$1 40.15,129.03 40.91,129.03 v41.67,128.27 | v47.92,130.86 48.99,130.86 R6.P$2 | v46.4,128.73 46.09,128.42 v43.35,128.42
  Bottom 0.152: v47.92,130.86 47.92,130.25 v46.4,128.73 | 43.35,128.27 43.35,125.22 42.44,124.31 P6.P$2 | 43.35,128.27 v41.67,128.27 | 43.35,128.27 v43.35,128.42
CH7  (via drill 0.35)
  Top 0.152: R7.P$2 48.53,103.58 49.14,102.97 49.14,101.45 48.99,101.3 44.72,101.3 44.11,101.91 40.15,101.91 C7.P$1 40,102.06 39.39,102.67 39.39,103.43 38.47,104.34 v38.47,105.26 38.47,106.78 40.3,108.61 v40.91,108.61 | v43.35,131.01 43.5,131.17 43.5,134.82 U$1.4
  Bottom 0.152: v43.35,131.01 42.74,130.41 42.74,130.25 37.56,125.07 37.56,124 35.73,122.17 35.73,117.15 37.86,115.01 37.86,105.87 v38.47,105.26 | v40.91,108.61 42.28,109.98 P7.P$2
CH8  (via drill 0.35)
  Top 0.152: 40.61,80.72 44.27,80.72 44.87,80.11 48.08,80.11 48.53,80.57 48.53,81.94 47.77,82.7 R8.P$2 | 40.61,80.72 40.15,80.72 C8.P$1 | v39.84,60.61 39.84,58.32 43.5,54.66 43.5,49.02 U$45.13 | v40.61,79.96 40.61,80.72
  Bottom 0.152: v39.84,60.61 39.84,62.59 43.66,66.4 43.66,73.41 42.44,74.63 40.45,74.63 40.3,74.78 40.3,79.66 v40.61,79.96 42.28,81.64 P8.P$2
CH9  (via drill 0.35)
  Top 0.152: 40.91,66.4 44.42,66.4 44.87,65.94 48.08,65.94 48.38,66.24 48.38,67.62 47.62,68.38 R9.P$2 | 40.91,66.4 40,66.4 C9.P$1 | v39.24,61.83 39.24,58.47 42.89,54.81 42.89,49.02 U$45.14 | v40.91,66.09 40.91,66.4
  Bottom 0.152: v39.24,61.83 39.24,64.42 v40.91,66.09 42.28,67.46 P9.P$2
CH10  (via drill 0.35)
  Top 0.152: v43.05,56.95 40.61,59.39 C10.P$1 | R10.P$2 47.31,61.22 47.31,60.61 48.08,59.84 48.08,49.94 46.7,48.57 46.7,48.11 46.55,47.96 42.74,47.96 42.44,48.26 42.44,48.87 U$45.15 42.28,49.02 v42.28,50.4
  Bottom 0.152: v43.05,56.95 43.66,56.34 43.66,54.66 42.44,53.44 P10.P$2 42.28,53.29 v42.28,50.4
CH11  (via drill 0.35)
  Top 0.152: C11.P$1 40.15,30.89 44.42,30.89 44.87,30.43 49.14,30.43 49.9,31.19 49.9,32.41 49.14,33.17 R11.P$2 48.99,33.33 48.99,38.35 v46.25,41.1 | v43.05,56.03 44.27,54.81 44.27,49.02 U$45.12
  Bottom 0.152: v43.05,56.03 42.59,56.03 41.06,54.51 41.06,49.02 43.05,47.04 43.05,41.1 | 43.05,41.1 43.05,40.18 42.44,39.57 P11.P$2 | 43.05,41.1 v46.25,41.1
CH12  (via drill 0.35)
  Top 0.152: v41.06,23.11 40.61,23.57 40.15,23.57 C12.P$1 | v43.35,26.32 45.94,26.32 46.55,25.71 48.99,25.71 R12.P$2 | v40.61,35.46 41.67,36.53 41.67,43.23 U$45.1
  Bottom 0.152: v41.06,23.11 41.06,23.42 42.28,24.64 P12.P$2 42.44,24.79 43.35,25.71 v43.35,26.32 43.35,31.19 42.59,31.95 40.61,31.95 40.3,32.26 40.3,33.33 40.61,33.63 v40.61,35.46
CH13  (via drill 0.35)
  Top 0.152: 43.05,12.75 43.05,11.84 42.59,11.38 | 42.59,11.38 41.83,10.62 41.83,6.96 42.74,6.05 43.96,6.05 44.72,6.81 R13.P$2 | v39.39,34.24 39.39,47.35 39.69,47.65 40.61,47.65 44.27,43.99 44.27,43.38 U$45.5 | v39.39,17.17 39.39,16.41 43.05,12.75 | 43.05,12.75 C13.P$1 | 42.59,11.38 v42.44,11.53
  Bottom 0.152: v39.39,17.17 v39.39,34.24 | v42.44,11.53 42.44,10.01 P13.P$2
CH14  (via drill 0.35)
  Top 0.152: 25.82,5.89 25.82,7.88 25.21,8.48 25.21,11.99 25.37,12.14 26.74,12.14 27.5,11.38 R14.P$2 27.65,11.38 33.9,11.38 37.56,15.04 37.56,31.5 42.28,36.22 42.28,43.23 U$45.2 | 25.82,5.89 25.82,2.85 C14.P$1 | 25.82,5.89 v25.37,5.89
  Bottom 0.152: v25.37,5.89 26.89,5.89 P14.P$2
CH15  (via drill 0.35)
  Top 0.152: C15.P$1 60.11,2.54 61.03,2.54 61.64,1.93 62.55,1.93 62.7,2.08 v62.7,5.89 62.7,10.62 61.94,11.38 R15.P$2 61.79,11.53 61.03,12.3 v53.1,12.3 | v45.03,36.98 43.66,38.35 43.66,43.23 U$45.4
  Bottom 0.152: v45.03,36.98 45.03,36.53 50.36,31.19 50.36,15.04 v53.1,12.3 | v62.7,5.89 61.03,5.89 P15.P$2
D2  (via drill 0.35)
  Top 0.152: X1.3 27.04,117.15 27.04,118.67 29.79,121.41 36.95,121.41 37.25,121.11 38.93,121.11 U1.32 39.08,120.96 40.76,119.28 v41.83,119.28 | v47.31,92.46 47.31,98.25 46.4,99.16 45.79,99.16 45.03,98.4 44.42,98.4 U$11.P$1 | v44.87,50.55 44.87,49.02 U$45.11 | v45.94,142.29 45.03,141.38 45.03,140.62 U$1.11 | v49.45,122.48 v49.45,125.07 | v49.45,120.19 48.99,120.19 48.68,119.89 v48.08,119.89 45.48,117.3 v43.96,117.3
  Bottom 0.152: v44.87,50.55 50.36,56.03 50.36,59.54 52.04,61.22 67.58,61.22 68.5,62.13 X2.3 68.5,62.28 64.84,65.94 52.65,65.94 50.06,68.53 50.06,88.65 47.31,91.39 v47.31,92.46 50.06,95.2 50.06,116.99 48.08,118.97 v48.08,119.89 | v45.94,142.29 48.84,139.4 48.84,125.68 v49.45,125.07 | v49.45,120.19 v49.45,122.48 | v41.83,119.28 43.81,117.3 v43.96,117.3
D3  (via drill 0.35)
  Top 0.152: 38.02,118.21 38.63,118.82 38.93,118.82 U1.1 | 38.02,118.21 32.23,118.21 32.07,118.36 v27.65,118.36 | U$12.P$1 44.42,95.81 v45.79,94.44 46.09,94.44 46.7,93.83 46.7,92.15 47.01,91.85 47.62,91.85 47.92,92.15 47.92,98.1 46.55,99.47 41.52,99.47 39.08,101.91 39.08,103.28 37.86,104.5 37.86,106.78 v40.61,109.53 | v45.48,58.32 45.48,49.02 U$45.10 | v43.35,61.98 44.57,61.98 v50.06,67.46 | v47.47,141.68 45.94,141.68 45.64,141.38 45.64,140.62 U$1.10 | v49.45,127.2 49.45,125.98 50.36,125.07 50.36,123.09 52.8,120.65 52.8,117.76 49.45,114.4 v49.45,104.65 | 38.02,118.21 38.02,116.99 38.78,116.23 v38.93,116.23
  Bottom 0.152: v27.65,118.36 26.13,118.36 X1.4 | 50.36,67.77 52.49,65.64 63.16,65.64 66.52,62.28 X2.4 | 50.36,67.77 49.75,68.38 49.75,88.5 45.79,92.46 v45.79,94.44 49.45,98.1 v49.45,104.65 | v45.48,58.32 45.48,59.08 43.35,61.22 v43.35,61.98 | 50.36,67.77 v50.06,67.46 | v47.47,141.68 47.47,141.22 49.45,139.24 v49.45,127.2 | v38.93,116.23 38.93,115.77 40.61,114.1 v40.61,109.53
D4  (via drill 0.35)
  Top 0.152: v47.01,140.31 46.86,140.46 46.25,140.46 U$1.9 | v44.87,126.14 42.89,126.14 42.74,126.29 39.84,126.29 36.19,122.63 24.76,122.63 22.32,120.19 22.32,117.6 22.78,117.15 X1.5 | 44.42,92.46 44.42,87.28 50.06,81.64 50.06,68.53 57.37,61.22 63.62,61.22 64.53,62.13 X2.5 | 44.42,92.46 44.42,93.22 U$13.P$1 | v38.63,117.3 38.63,117.45 39.39,118.21 U1.2 | v39.39,100.53 41.06,98.86 41.06,92.61 41.22,92.46 44.42,92.46 | v46.25,55.88 46.25,49.02 U$45.9 | v28.41,118.97 35.27,118.97 35.73,118.52 37.41,118.52 v37.71,118.82
  Bottom 0.152: v47.01,140.31 47.77,139.55 47.92,139.55 48.53,138.94 48.53,129.8 v44.87,126.14 | v39.39,100.53 39.39,103.43 40,104.04 40,114.25 38.32,115.93 38.32,116.54 38.63,116.84 v38.63,117.3 37.71,118.21 v37.71,118.82 | v46.25,55.88 53.41,63.04 63.77,63.04 64.53,62.28 X2.5 | X1.5 23.54,117.15 25.37,118.97 v28.41,118.97
D5  (via drill 0.35)
  Top 0.152: v45.94,108.46 45.94,113.64 45.03,114.56 45.03,114.86 U1.9 | v49.29,60.3 49.29,51.92 50.36,50.85 50.36,15.04 52.49,12.9 v67.43,12.9
  Bottom 0.152: v45.94,108.46 44.11,106.63 44.11,93.68 49.29,88.5 v49.29,60.3 | v67.43,12.9 70.33,10.01 U$97.P$4
D6  (via drill 0.35)
  Top 0.152: v44.72,116.69 45.48,115.93 45.48,115.62 U1.10 | v36.8,122.33 25.37,122.33 v22.93,119.89
  Bottom 0.152: v44.72,116.69 44.72,117.45 42.13,120.04 42.13,121.87 40.15,123.85 38.02,123.85 36.8,122.63 v36.8,122.33 | v22.93,119.89 21.71,119.89 18.97,117.15 X1.7
D7
  Top 0.152: U1.11 46.25,115.93 46.25,115.62 48.84,113.03 48.84,104.34 50.36,102.82 50.36,68.68 56.76,62.28 60.42,62.28 X2.7
GND  (via drill 0.35)
  Top 0.152: C6.P$2 40,131.01 40,130.71 v39.54,130.25 39.39,130.1 39.39,126.29 36.34,123.24 16.07,123.24 13.79,120.96 12.26,120.96 LED8.K | C2.P$2 53.26,159.21 53.26,153.11 V2.P$3 | V3.P$3 68.8,153.11 68.95,153.26 v68.95,158.29 68.95,159.21 C3.P$2 68.95,159.36 68.34,159.97 66.67,159.97 66.06,159.36 53.41,159.36 C2.P$2 | 41.83,146.25 45.18,146.25 45.33,146.1 V5.P$3 | 41.83,146.25 38.93,146.25 C5.P$2 38.78,146.25 38.32,146.25 37.86,145.8 37.86,139.7 38.63,138.94 U$8.P$2 38.63,138.79 41.67,138.79 44.87,135.59 44.87,134.98 U$1.6 45.03,134.82 45.48,134.82 | V0.P$3 20.8,153.11 20.8,159.21 C0.P$2 20.95,159.36 33.6,159.36 34.05,159.82 35.58,159.82 36.34,159.06 C1.P$2 36.49,159.06 | 36.49,159.06 36.49,153.26 36.34,153.11 V1.P$3 36.34,152.96 36.49,152.81 38.78,152.81 C4.P$2 38.93,152.81 v40,152.81 41.83,152.81 | 41.83,152.81 45.33,152.81 V4.P$3 | 41.83,152.81 41.83,146.25 | 36.49,159.06 37.41,159.97 51.73,159.97 52.34,159.36 53.26,159.36 C2.P$2 | C7.P$2 40.15,104.04 44.87,104.04 45.18,103.73 V7.P$3 | 40,116.38 40.3,116.08 40.61,116.08 41.06,116.54 U1.5 41.22,116.69 41.22,116.99 46.25,122.02 46.25,122.78 46.7,123.24 U1.21 46.86,123.39 v48.53,125.07 48.68,125.22 48.68,126.29 U$44.P$2 48.84,126.29 48.84,127.81 49.9,128.88 49.9,129.49 49.14,130.25 45.94,130.25 45.48,130.71 V6.P$3 45.48,130.86 45.48,134.82 | 40,116.38 39.54,116.84 40,117.3 40,117.6 U1.3 | 42.28,108 42.28,109.83 40.15,111.96 | 42.28,108 42.28,107.24 U$9.P$2 | Y1.2 40.15,111.96 | v41.37,113.95 40.15,112.73 Y1.2 | 38.32,114.71 37.86,114.25 37.86,111.81 38.63,111.05 39.24,111.05 40.15,111.96
  Top 0.152: 38.32,114.71 40,116.38 | 40.15,112.27 Y1.2 | 38.32,114.71 36.49,116.54 33.44,116.54 31.92,118.06 29.94,118.06 29.02,117.15 X1.2 | 42.28,108 40.15,108 39.84,107.7 39.84,106.78 40,106.63 40,104.19 C7.P$2 | S1.3 75.51,117.91 75.51,121.87 S1.4 74.59,122.02 73.53,123.09 59.05,123.09 58.29,122.33 U$15.P$2 | U$1.8 46.09,134.82 45.64,134.82 U$1.7 45.48,134.82 | C15.P$2 62.1,2.69 62.1,3.46 60.11,5.44 60.11,8.79 V15.P$3 60.11,8.94 46.09,8.94 | 27.81,3.76 27.81,2.85 C14.P$2 | 27.81,3.76 26.13,5.44 26.13,8.79 V14.P$3 | 41.83,25.55 45.33,25.55 V12.P$3 | 41.83,25.55 40.15,25.55 C12.P$2 40,25.71 39.39,26.32 39.39,31.34 40,31.95 40,32.87 C11.P$2 40.15,32.87 45.33,32.87 V11.P$3 45.48,32.87 45.48,36.53 45.64,36.68 45.64,43.23 | 41.83,25.55 41.83,24.03 45.03,20.83 v45.03,13.82 45.03,12.75 C13.P$2 45.18,12.75 45.18,10.92 45.33,10.77 V13.P$3 45.48,10.62 46.09,10.01 46.09,8.94 | 27.81,3.76 42.89,3.76 46.09,6.96 46.09,8.94 | LED6.K v40.15,94.59 40.15,93.37 LED7.K 40.15,93.22 C8.P$2 40.15,82.7 | LED6.K 40.15,98.1 LED5.K | LED6.K | 40.15,82.7 45.18,82.7 45.33,82.55 V8.P$3 | U$45.6 45.03,43.23 45.48,43.23 U$45.7 45.64,43.23 | 45.64,43.23 46.09,43.23 U$45.8 46.25,43.38 49.75,46.89 49.75,49.48 49.14,50.09 49.14,51 U$78.P$2 48.99,51.16 48.99,59.69 48.68,60 48.68,61.06 | C9.P$2 40,68.38 45.33,68.38 V9.P$3 | 48.68,61.06 47.92,61.83 46.25,61.83 45.48,61.06 V10.P$3 45.33,61.06 45.03,61.37 40.61,61.37 C10.P$2 40.45,61.52 39.24,62.74 39.24,64.72 | 48.68,61.06 48.84,60.91 68.65,60.91 69.87,62.13 70.48,62.13 X2.2 | 39.24,64.72 39.24,67.01 39.84,67.62 39.84,68.38 C9.P$2 | 39.24,64.72 37.71,64.72 36.04,66.4 28.72,66.4 U$10.P$5
  Top 0.152: 40.15,82.7 40.15,81.94 39.39,81.18 39.39,68.99 39.84,68.53 C9.P$2 | v40,103.12 40,104.04 C7.P$2
  Bottom 0.152: U$85.P$3 41.37,130.56 41.06,130.25 v39.54,130.25 39.54,134.98 38.32,136.2 38.32,142.29 40.91,144.88 | 40.91,144.88 40.61,145.19 40.45,145.19 40,145.65 v40,152.81 40,156.92 | 40.91,144.88 41.37,144.43 U$84.P$3 | 40,156.92 41.37,158.29 U$83.P$3 | U$79.P$3 11.5,157.07 12.26,157.84 12.26,157.99 12.41,158.14 25.82,158.14 26.89,157.07 U$80.P$3 27.04,156.92 27.04,156.62 27.96,155.7 28.87,155.7 30.85,157.68 37.25,157.68 38.02,156.92 40,156.92 | U$81.P$3 59.51,157.07 60.27,157.84 60.27,157.99 60.57,158.29 v68.95,158.29 73.68,158.29 74.9,157.07 U$82.P$3 | v41.37,113.95 41.37,116.38 U$86.P$3 | v48.53,125.07 50.36,123.24 56.76,123.24 57.68,122.33 58.13,122.33 U$15.P$2 | 40.76,31.34 41.37,31.34 U$92.P$3 40.76,31.34 | 40.76,31.34 40,32.11 40,43.99 41.37,45.37 U$91.P$3 | 34.36,10.31 34.66,10.01 U$95.P$3 34.36,10.31 | 34.36,10.31 33.29,11.38 18.51,11.38 17.75,10.62 17.75,10.01 U$94.P$3 | 34.36,10.31 40.61,16.56 41.37,16.56 U$93.P$3 | 42.28,16.56 v45.03,13.82 48.84,10.01 51.58,10.01 U$96.P$3 51.73,10.01 51.73,10.62 52.49,11.38 60.72,11.38 62.1,10.01 68.65,10.01 U$97.P$3 | 42.28,16.56 41.52,16.56 U$93.P$3 | 40.76,31.34 40.76,23.72 40.45,23.42 40.45,20.83 42.74,18.54 42.74,17.02 42.28,16.56 | 42.28,16.56 U$93.P$3 | 40.3,94.59 40.3,100.99 41.22,101.91 | 40.3,94.59 40.3,88.95 41.06,88.19 41.37,88.19 U$88.P$3 41.37,88.04 41.37,83.16 40,81.79 40,74.63 40.76,73.86 41.37,73.86 U$89.P$3 41.37,73.71 41.37,71.12 38.63,68.38 38.63,60.91 39.69,59.84 41.37,59.84 U$90.P$3 | 41.22,101.91 41.37,102.06 U$87.P$3 41.22,101.91 | v40.15,94.59 40.3,94.59 | 41.22,101.91 v40,103.12
  pour Top: -22.08,178.36 -22.08,14.53 -13.19,5.64 13.48,-21.03 99.84,-21.03 122.7,1.83 122.7,150.42 92.22,180.9 0.78,180.9 -19.54,180.9
  pour Bottom: -4.3,172.01 -14.46,161.85 -14.46,37.39 -14.46,22.15 12.21,-4.52 89.68,-4.52 112.54,18.34 112.54,76.76 112.54,145.34 87.14,170.74 85.87,172.01
MISO  (via drill 0.35)
  Top 0.152: v50.21,119.28 49.9,118.97 48.99,118.97 U1.16
  Bottom 0.152: v50.21,119.28 61.18,119.28 64.08,122.17 U$15.P$5
MOSI  (via drill 0.35)
  Top 0.152: v51.27,119.89 51.27,119.43 49.75,117.91 49.14,117.91 48.84,118.21 48.53,118.21 U1.15
  Bottom 0.152: v51.27,119.89 51.73,119.89 51.88,119.74 59.66,119.74 62.1,122.17 U$15.P$4
N$2
  Top 0.152: R0.P$1 18.97,150.52 18.97,152.81 19.12,152.96 V0.P$2 19.27,153.11 19.88,153.72 19.88,155.86 V0.P$1
N$3
  Top 0.152: R1.P$1 34.21,150.52 34.21,152.35 34.82,152.96 V1.P$2 34.97,153.11 35.58,153.72 V1.P$1
N$4
  Top 0.152: R2.P$1 51.88,150.52 51.88,152.81 51.73,152.96 V2.P$2 51.73,153.11 52.34,153.72 52.34,155.86 V2.P$1
N$5  (via drill 0.35)
  Top 0.152: U$9.P$1 41.37,107.24 42.28,106.33 v44.72,106.33 | v46.86,121.11 46.86,122.33 47.16,122.63 U1.20
  Bottom 0.152: v44.72,106.33 48.99,110.59 48.99,117.6 46.86,119.74 v46.86,121.11
N$6
  Top 0.152: U$7.P$2 26.13,64.61 26.13,66.4 U$10.P$4
N$7  (via drill 0.35)
  Top 0.152: v40.45,120.65 39.54,121.57 U1.31 | v38.47,113.79 v40.15,115.47
  Bottom 0.152: v40.45,120.65 40.45,119.13 40,118.67 40,115.62 v40.15,115.47 | v38.47,113.79 38.47,106.17 39.08,105.56 39.08,104.95 37.56,103.43 37.56,68.68 34.05,65.18 22.32,65.18 21.1,66.4 U$10.P$2
N$8  (via drill 0.35)
  Top 0.152: v41.22,121.41 41.06,121.41 40.45,122.02 40.15,122.02 U1.30 | v25.37,64.57 23.54,66.4 U$10.P$3
  Bottom 0.152: v41.22,121.41 40.76,121.41 38.93,123.24 38.32,123.24 38.02,122.94 38.02,120.5 36.8,119.28 36.8,116.54 39.39,113.95 39.39,104.8 37.86,103.28 37.86,68.53 33.9,64.57 v25.37,64.57
N$9
  Top 0.152: U1.7 42.28,115.47 41.98,115.47 40.15,113.64 39.84,113.64 39.08,112.88 39.08,112.42 Y1.1
N$10
  Top 0.152: U1.8 42.89,114.86 42.89,113.95 41.37,112.42 Y1.3
N$11
  Top 0.152: U$13.P$2 46.09,93.37 45.33,93.37 44.57,94.13 42.74,94.13 41.98,93.37 LED7.A
N$12
  Top 0.152: U$12.P$2 45.48,95.81 44.72,96.57 42.74,96.57 41.98,95.81 LED6.A
N$13
  Top 0.152: U$11.P$2 46.09,98.25 45.33,98.25 44.57,97.49 42.59,97.49 41.98,98.1 LED5.A
N$14
  Top 0.152: U$14.P$2 14.7,119.13 12.26,119.13 LED8.A
N$15
  Top 0.152: R3.P$1 67.28,150.52 67.28,152.96 V3.P$2 67.28,153.11 67.89,153.72 67.89,155.86 V3.P$1
N$16
  Top 0.152: R4.P$1 47.77,150.83 45.79,150.83 45.48,151.13 V4.P$2 45.33,151.28 44.72,151.89 42.59,151.89 V4.P$1
N$17
  Top 0.152: R5.P$1 48.38,144.27 45.79,144.27 45.48,144.58 V5.P$2 45.33,144.73 44.72,145.34 V5.P$1
N$18
  Top 0.152: R6.P$1 48.99,129.34 45.48,129.34 V6.P$2 45.33,129.49 44.72,130.1 V6.P$1
N$19
  Top 0.152: R7.P$1 45.48,101.91 45.33,102.06 V7.P$2 45.18,102.21 44.57,102.82 42.44,102.82 V7.P$1
N$21
  Top 0.152: R8.P$1 47.77,81.03 45.48,81.03 V8.P$2 45.33,81.03 44.72,81.64 42.59,81.64 V8.P$1
N$22
  Top 0.152: R9.P$1 47.47,66.7 45.48,66.7 V9.P$2 45.33,66.85 44.72,67.46 42.59,67.46 V9.P$1
N$23
  Top 0.152: R10.P$1 47.16,59.54 45.48,59.54 V10.P$2 45.33,59.54 44.72,60.15 42.59,60.15 V10.P$1
N$24
  Top 0.152: R11.P$1 48.99,31.34 45.48,31.34 V11.P$2 45.33,31.34 44.72,31.95 42.59,31.95 V11.P$1
N$25
  Top 0.152: R12.P$1 48.99,23.88 45.48,23.88 V12.P$2 45.33,24.03 44.72,24.64 42.59,24.64 V12.P$1
N$26
  Top 0.152: 44.42,8.18 45.33,9.09 V13.P$2 | 44.42,8.18 43.2,6.96 R13.P$1 | 44.42,8.18 44.27,8.18 42.59,9.86 V13.P$1
N$27
  Top 0.152: R14.P$1 25.82,11.23 25.82,10.77 27.65,8.94 V14.P$2 27.65,8.79 27.04,8.18 27.04,6.05 V14.P$1
N$28
  Top 0.152: R15.P$1 60.11,11.38 60.11,10.47 61.64,8.94 V15.P$2 61.64,8.79 61.03,8.18 61.03,6.05 V15.P$1
N$31
  Bottom 0.152: U$80.P$2 26.89,152.05 25.06,152.05 22.32,154.79 15.16,154.79 13.02,156.92 U$79.P$4
N$32
  Bottom 0.152: U$81.P$2 59.35,152.05 58.9,152.05 50.36,160.58 32.07,160.58 28.57,157.07 U$80.P$4
N$33
  Bottom 0.152: U$82.P$2 74.9,152.05 71.39,152.05 68.65,154.79 63.16,154.79 61.03,156.92 U$81.P$4
N$34
  Bottom 0.152: U$82.P$4 76.42,156.92 76.42,153.72 75.66,152.96 75.66,150.98 75.2,150.52 52.65,150.52 46.55,156.62 46.55,158.29 U$83.P$2
N$35
  Bottom 0.152: U$83.P$4 41.52,159.67 41.83,159.67 43.96,157.53 43.96,146.56 46.09,144.43 46.4,144.43 U$84.P$2
N$36  (via drill 0.35)
  Top 0.152: v42.44,146.86 42.74,147.17 42.74,147.32 43.05,147.63 46.4,147.63 v47.16,146.86 | v47.62,138.94 v49.14,140.46
  Bottom 0.152: v42.44,146.86 41.52,145.95 U$84.P$4 | v47.16,146.86 49.14,144.88 v49.14,140.46 | v47.62,138.94 47.62,131.62 46.55,130.56 U$85.P$2
N$37
  Bottom 0.152: U$85.P$4 41.52,132.08 43.2,132.08 43.96,131.32 43.96,118.67 46.09,116.54 46.4,116.54 U$86.P$2
N$38  (via drill 0.35)
  Top 0.152: v45.18,105.41 45.18,105.87 45.33,106.02 45.33,113.79 43.96,115.16 v43.96,116.08
  Bottom 0.152: v45.18,105.41 45.18,103.28 45.48,102.97 45.64,102.97 46.4,102.21 U$87.P$2 | v43.96,116.08 42.28,117.76 41.52,117.76 U$86.P$4
N$39
  Bottom 0.152: U$88.P$2 46.4,88.19 46.09,88.19 42.74,91.54 42.74,102.67 41.83,103.58 41.52,103.58 U$87.P$4
N$40
  Bottom 0.152: U$89.P$2 46.4,73.86 45.64,74.63 45.48,74.63 43.66,76.45 43.66,87.58 41.52,89.71 U$88.P$4
N$41
  Bottom 0.152: U$90.P$2 46.4,59.84 46.09,59.84 43.96,61.98 43.96,73.56 42.28,75.24 41.52,75.24 U$89.P$4
N$42
  Bottom 0.152: U$91.P$2 46.4,45.52 46.09,45.52 43.96,47.65 43.96,58.93 41.52,61.37 U$90.P$4
N$43
  Bottom 0.152: U$92.P$2 46.4,31.34 45.64,32.11 45.48,32.11 41.06,36.53 41.06,43.23 42.74,44.91 42.74,45.82 41.52,47.04 U$91.P$4
N$44
  Bottom 0.152: U$93.P$2 46.4,16.71 46.09,16.71 43.96,18.85 43.96,31.04 42.28,32.72 41.52,32.72 U$92.P$4
N$45
  Bottom 0.152: U$94.P$2 17.6,4.98 17.6,8.33 16.98,8.94 16.98,10.92 19.88,13.82 36.95,13.82 41.06,17.93 41.37,17.93 U$93.P$4
N$46
  Bottom 0.152: U$94.P$4 19.27,9.86 23.54,9.86 26.28,7.11 32.53,7.11 34.66,4.98 U$95.P$2
N$47
  Bottom 0.152: U$95.P$4 36.34,9.86 40,9.86 44.87,4.98 51.58,4.98 U$96.P$2
N$48
  Bottom 0.152: U$96.P$4 53.26,9.86 57.52,9.86 60.27,7.11 66.52,7.11 68.65,4.98 U$97.P$2
RES  (via drill 0.35)
  Top 0.152: S1.1 73.37,117.91 73.37,121.87 S1.2 73.22,122.02 68.34,122.02 68.19,122.17 U$15.P$7 | v40.76,87.12 40.76,89.26 v43.35,91.85 | v41.22,120.04 41.22,120.5 41.83,121.11 41.83,121.72 40.76,122.78 U1.29 | v33.75,63.96 33.75,62.84 U$7.P$1 | v36.34,120.04 U$6.P$1 | v50.82,117.6 50.36,117.6 v48.08,115.32
  Bottom 0.152: v33.75,63.96 39.69,69.9 39.69,86.06 v40.76,87.12 | v43.35,91.85 43.35,108.61 43.66,108.92 43.66,115.32 | 43.66,115.32 43.66,115.47 42.74,116.38 42.74,116.84 42.44,117.15 40.45,117.15 40.3,117.3 40.3,118.52 41.22,119.43 v41.22,120.04 41.83,120.65 41.83,121.72 40,123.55 38.17,123.55 37.71,123.09 37.71,122.33 36.34,120.96 v36.34,120.04 | v50.82,117.6 62.86,117.6 67.43,122.17 68.04,122.17 U$15.P$7 | 43.66,115.32 v48.08,115.32
SCK  (via drill 0.35)
  Top 0.152: v51.43,121.11 48.99,121.11 U1.17
  Bottom 0.152: v51.43,121.11 58.29,121.11 59.2,122.02 59.2,122.63 59.66,123.09 65.3,123.09 66.06,122.33 U$15.P$6
SS  (via drill 0.35)
  Top 0.152: v52.19,120.35 52.19,119.89 49.6,117.3 48.68,117.3 48.38,117.6 47.92,117.6 U1.14
  Bottom 0.152: v52.19,120.35 58.29,120.35 60.11,122.17 U$15.P$3

### Text on the board
tPlace: L | toMAIN | 1 | 2 | 4 | R